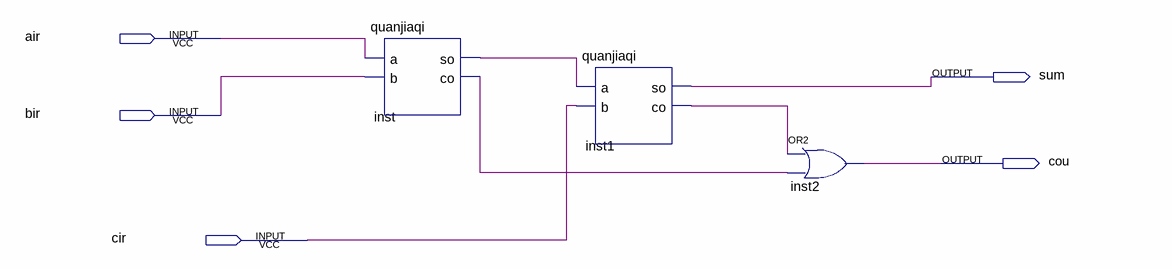
[diagram p0: schematic sheet]
// Quartus schematic main_quan.bdf as structural Verilog: 3 symbols, 5 pins
module main_quan (
  input  air,
  input  bir,
  input  cir,
  output sum,
  output cou
);

  wire inst1_co, inst_co, inst_so;

  quanjiaqi inst (.a(air), .b(bir), .so(inst_so), .co(inst_co));
  quanjiaqi inst1 (.a(inst_so), .b(cir), .so(sum), .co(inst1_co));
  or inst2 (cou, inst1_co, inst_co);
endmodule
